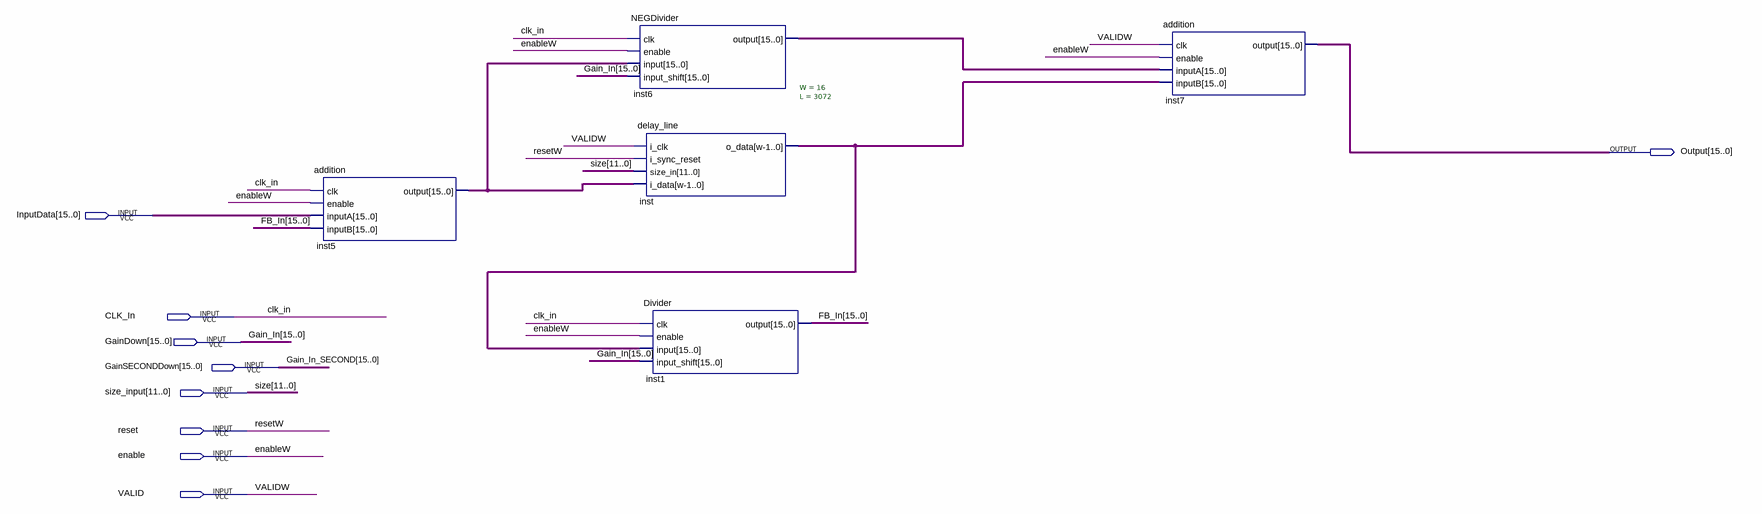
[diagram p0: schematic sheet]
// Quartus schematic ALLPASSTEST.bdf as structural Verilog: 5 symbols, 9 pins
module ALLPASSTEST (
  input  [15:0] InputData,
  input  CLK_In,
  input  [15:0] GainDown,
  input  [15:0] GainSECONDDown,
  input  [11:0] size_input,
  input  reset,
  input  enable,
  input  VALID,
  output [15:0] Output
);

  wire [15:0] FB_In, inst5_output, inst6_output, inst_o_data;

  addition inst5 (.clk(CLK_In), .enable(enable), .inputA(InputData), .inputB(FB_In), .\output (inst5_output));
  NEGDivider inst6 (
    .clk(CLK_In), .enable(enable), .\input (inst5_output), .input_shift(GainDown), .\output (inst6_output));
  delay_line #(.W(16), .L(3072)) inst (
    .i_clk(VALID), .i_sync_reset(reset), .size_in(size_input), .i_data(inst5_output), .o_data(inst_o_data));
  Divider inst1 (.clk(CLK_In), .enable(enable), .\input (inst_o_data), .input_shift(GainDown), .\output (FB_In));
  addition inst7 (.clk(VALID), .enable(enable), .inputA(inst6_output), .inputB(inst_o_data), .\output (Output));

  // Other names for the same wires on the sheet: enableW = enable; Gain_In[15:0] = GainDown;
  //   Gain_In_SECOND[15:0] = GainSECONDDown; resetW = reset; size[11:0] = size_input; VALIDW = VALID
endmodule
